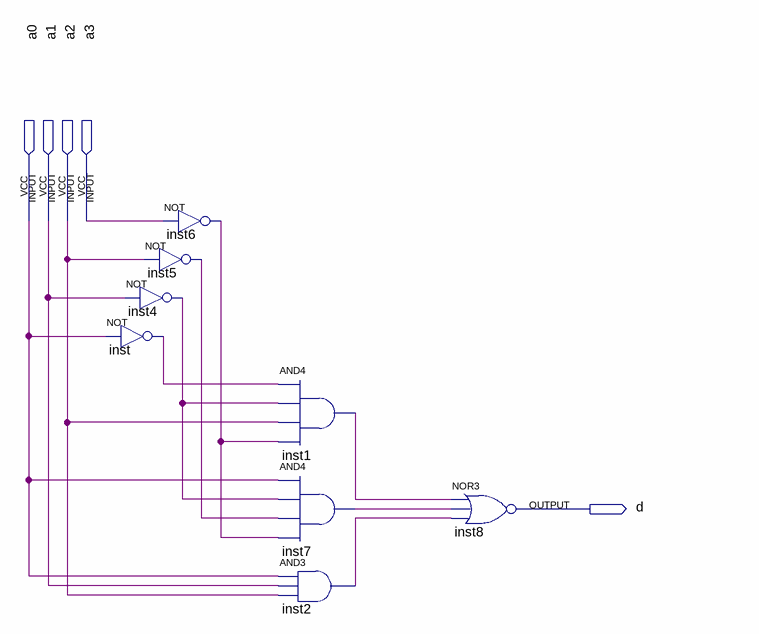
[diagram p0: schematic sheet]
// Quartus schematic D.bdf as structural Verilog: 8 symbols, 5 pins
module D (
  input  a0,
  input  a1,
  input  a2,
  input  a3,
  output d
);

  wire inst1_out, inst2_out, inst4_out, inst5_out, inst6_out, inst7_out, inst_out;

  not inst4 (inst4_out, a1);
  not inst (inst_out, a0);
  not inst6 (inst6_out, a3);
  not inst5 (inst5_out, a2);
  and inst1 (inst1_out, inst_out, inst4_out, a2, inst6_out);
  and inst7 (inst7_out, a0, inst4_out, inst5_out, inst6_out);
  and inst2 (inst2_out, a0, a1, a2);
  nor inst8 (d, inst1_out, inst7_out, inst2_out);
endmodule
